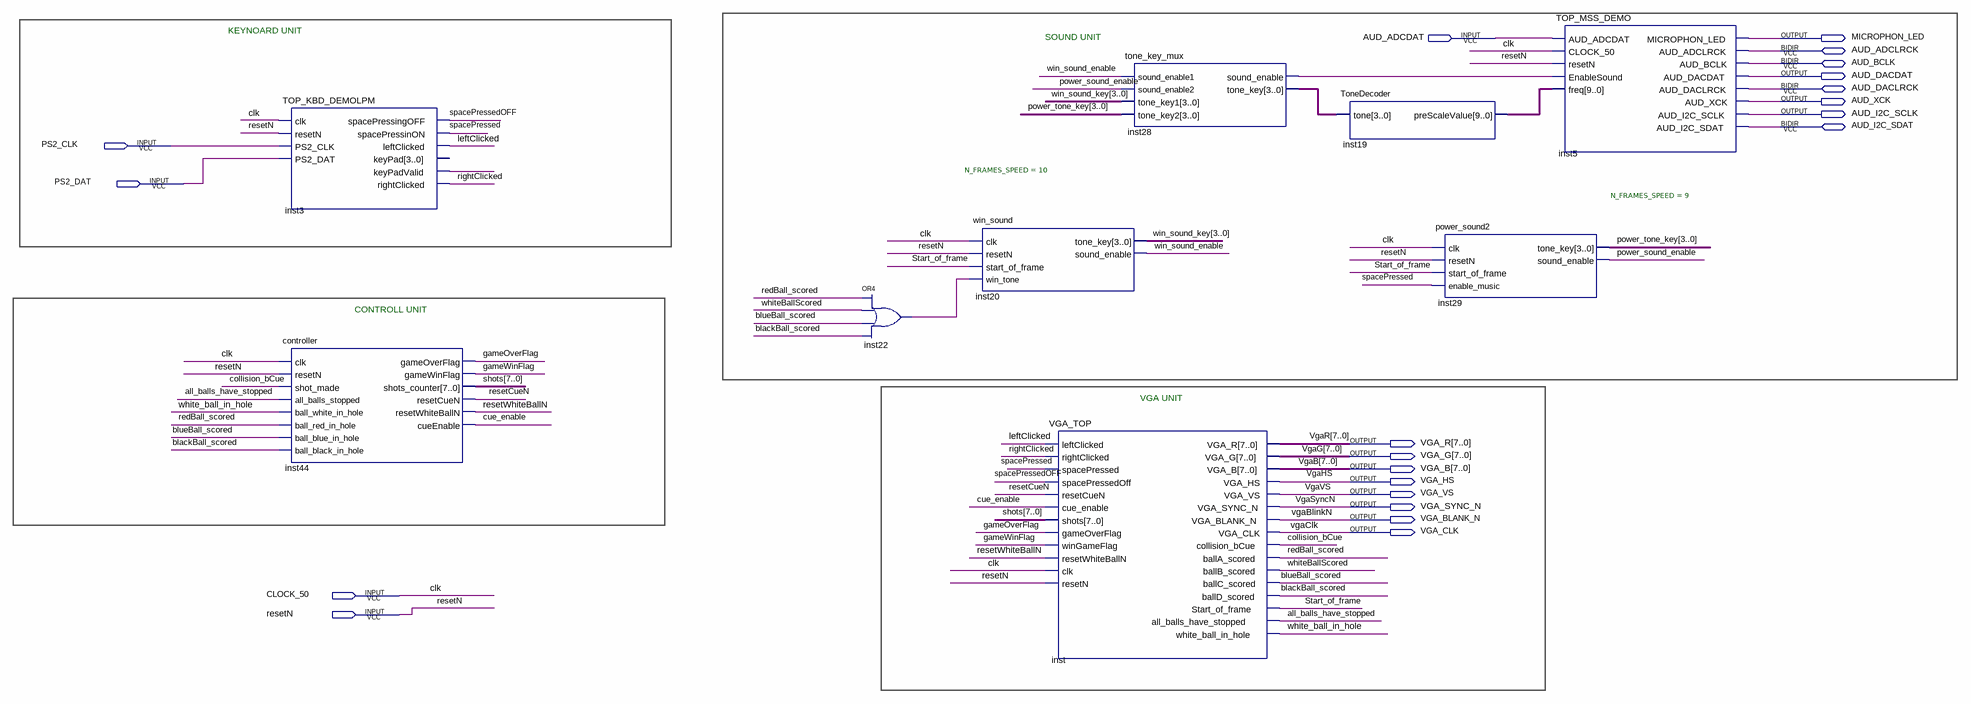
[diagram p0: schematic sheet]
// Quartus schematic TOP_VGA_DEMO_WITH_MSS.bdf as structural Verilog: 9 symbols, 21 pins
module TOP_VGA_DEMO_WITH_MSS (
  input  AUD_ADCDAT,
  input  PS2_CLK,
  input  PS2_DAT,
  input  CLOCK_50,
  input  resetN,
  inout  AUD_ADCLRCK,
  inout  AUD_BCLK,
  inout  AUD_DACLRCK,
  inout  AUD_I2C_SDAT,
  output MICROPHON_LED,
  output AUD_DACDAT,
  output AUD_XCK,
  output AUD_I2C_SCLK,
  output [7:0] VGA_R,
  output [7:0] VGA_G,
  output [7:0] VGA_B,
  output VGA_HS,
  output VGA_VS,
  output VGA_SYNC_N,
  output VGA_BLANK_N,
  output VGA_CLK
);

  wire all_balls_have_stopped, blackBall_scored, blueBall_scored, collision_bCue, cue_enable, gameOverFlag,
       gameWinFlag, inst3_keypadvalid, inst22_out, inst28_sound_enable, leftClicked, power_sound_enable,
       redBall_scored, resetCueN, resetWhiteBallN, rightClicked, spacePressed, spacePressedOFF,
       Start_of_frame, white_ball_in_hole, whiteBallScored, win_sound_enable;
  wire [3:0] inst28_tone_key, power_tone_key, win_sound_key;
  wire [7:0] shots;
  wire [9:0] inst19_prescalevalue;

  TOP_KBD_DEMOLPM inst3 (
    .clk(CLOCK_50), .resetN(resetN), .PS2_CLK(PS2_CLK), .PS2_DAT(PS2_DAT),
    .spacePressingOFF(spacePressedOFF), .spacePressinON(spacePressed), .leftClicked(leftClicked),
    .keyPadValid(inst3_keypadvalid), .rightClicked(rightClicked));  // open: keyPad
  controller inst44 (
    .clk(CLOCK_50), .resetN(resetN), .shot_made(collision_bCue), .all_balls_stopped(all_balls_have_stopped),
    .ball_white_in_hole(white_ball_in_hole), .ball_red_in_hole(redBall_scored),
    .ball_blue_in_hole(blueBall_scored), .ball_black_in_hole(blackBall_scored), .gameOverFlag(gameOverFlag),
    .gameWinFlag(gameWinFlag), .shots_counter(shots), .resetCueN(resetCueN),
    .resetWhiteBallN(resetWhiteBallN), .cueEnable(cue_enable));
  or inst22 (inst22_out, redBall_scored, whiteBallScored, blueBall_scored, blackBall_scored);
  win_sound #(.N_FRAMES_SPEED(10)) inst20 (
    .clk(CLOCK_50), .resetN(resetN), .start_of_frame(Start_of_frame), .win_tone(inst22_out),
    .tone_key(win_sound_key), .sound_enable(win_sound_enable));
  VGA_TOP inst (
    .leftClicked(leftClicked), .rightClicked(rightClicked), .spacePressed(spacePressed),
    .spacePressedOff(spacePressedOFF), .resetCueN(resetCueN), .cue_enable(cue_enable), .shots(shots),
    .gameOverFlag(gameOverFlag), .winGameFlag(gameWinFlag), .resetWhiteBallN(resetWhiteBallN),
    .clk(CLOCK_50), .resetN(resetN), .VGA_R(VGA_R), .VGA_G(VGA_G), .VGA_B(VGA_B), .VGA_HS(VGA_HS),
    .VGA_VS(VGA_VS), .VGA_SYNC_N(VGA_SYNC_N), .VGA_BLANK_N(VGA_BLANK_N), .VGA_CLK(VGA_CLK),
    .collision_bCue(collision_bCue), .ballA_scored(redBall_scored), .ballB_scored(whiteBallScored),
    .ballC_scored(blueBall_scored), .ballD_scored(blackBall_scored), .Start_of_frame(Start_of_frame),
    .all_balls_have_stopped(all_balls_have_stopped), .white_ball_in_hole(white_ball_in_hole));
  tone_key_mux inst28 (
    .sound_enable1(win_sound_enable), .sound_enable2(power_sound_enable), .tone_key1(win_sound_key),
    .tone_key2(power_tone_key), .sound_enable(inst28_sound_enable), .tone_key(inst28_tone_key));
  ToneDecoder inst19 (.tone(inst28_tone_key), .preScaleValue(inst19_prescalevalue));
  power_sound2 #(.N_FRAMES_SPEED(9)) inst29 (
    .clk(CLOCK_50), .resetN(resetN), .start_of_frame(Start_of_frame), .enable_music(spacePressed),
    .tone_key(power_tone_key), .sound_enable(power_sound_enable));
  TOP_MSS_DEMO inst5 (
    .AUD_ADCDAT(AUD_ADCDAT), .CLOCK_50(CLOCK_50), .resetN(resetN), .EnableSound(inst28_sound_enable),
    .freq(inst19_prescalevalue), .MICROPHON_LED(MICROPHON_LED), .AUD_DACDAT(AUD_DACDAT), .AUD_XCK(AUD_XCK),
    .AUD_I2C_SCLK(AUD_I2C_SCLK), .AUD_ADCLRCK(AUD_ADCLRCK), .AUD_BCLK(AUD_BCLK), .AUD_DACLRCK(AUD_DACLRCK),
    .AUD_I2C_SDAT(AUD_I2C_SDAT));

  // Other names for the same wires on the sheet: clk = CLOCK_50; VgaB[7:0] = VGA_B; vgaBlinkN = VGA_BLANK_N;
  //   vgaClk = VGA_CLK; VgaG[7:0] = VGA_G; VgaHS = VGA_HS; VgaR[7:0] = VGA_R; VgaSyncN = VGA_SYNC_N; VgaVS = VGA_VS

  // Notes on the sheet:
  //   KEYNOARD UNIT
  //   SOUND UNIT
  //   CONTROLL UNIT
  //   VGA UNIT
endmodule
